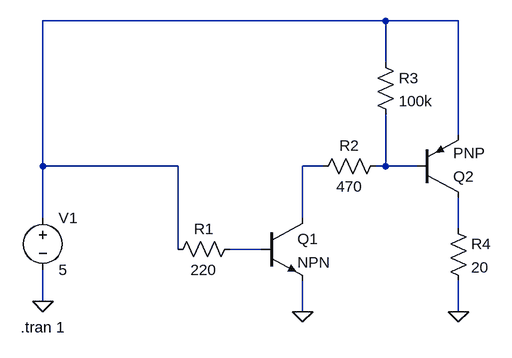
[diagram p0: schematic simu_alim_3-3V.asc]
simu_alim_3-3V.asc, the LTspice schematic file:
Version 4
SHEET 1 880 680
WIRE 512 -192 -16 -192
WIRE 624 -192 512 -192
WIRE 512 -128 512 -192
WIRE 624 -16 624 -192
WIRE -16 32 -16 -192
WIRE 192 32 -16 32
WIRE 416 32 384 32
WIRE 512 32 512 -48
WIRE 512 32 496 32
WIRE 560 32 512 32
WIRE -16 112 -16 32
WIRE 384 112 384 32
WIRE 624 128 624 80
WIRE 192 160 192 32
WIRE 320 160 272 160
WIRE -16 240 -16 192
WIRE 384 256 384 208
WIRE 624 256 624 208
FLAG -16 240 0
FLAG 384 256 0
FLAG 624 256 0
SYMBOL voltage -16 96 R0
WINDOW 123 0 0 Left 0
WINDOW 39 0 0 Left 0
SYMATTR InstName V1
SYMATTR Value 5
SYMBOL res 288 144 R90
WINDOW 0 0 56 VBottom 2
WINDOW 3 32 56 VTop 2
SYMATTR InstName R1
SYMATTR Value 220
SYMBOL npn 320 112 R0
SYMATTR InstName Q1
SYMBOL res 512 16 R90
WINDOW 0 0 56 VBottom 2
WINDOW 3 32 56 VTop 2
SYMATTR InstName R2
SYMATTR Value 470
SYMBOL pnp 560 80 M180
SYMATTR InstName Q2
SYMBOL res 496 -144 R0
SYMATTR InstName R3
SYMATTR Value 100k
SYMBOL res 608 112 R0
SYMATTR InstName R4
SYMATTR Value 20
TEXT -50 280 Left 2 !.tran 1

The netlist it stands for:
* simu_alim_3-3V.asc
V1 N001 0 5
R1 N005 N001 220
Q1 N002 N005 0 0 NPN
R2 N003 N002 470
Q2 N004 N003 N001 0 PNP
R3 N001 N003 100k
R4 N004 0 20
.model NPN NPN
.model PNP PNP
.lib standard.bjt
.tran 1
.backanno
.end